# Altium schematic sheet DTX1-1740P.SchDoc
size A4
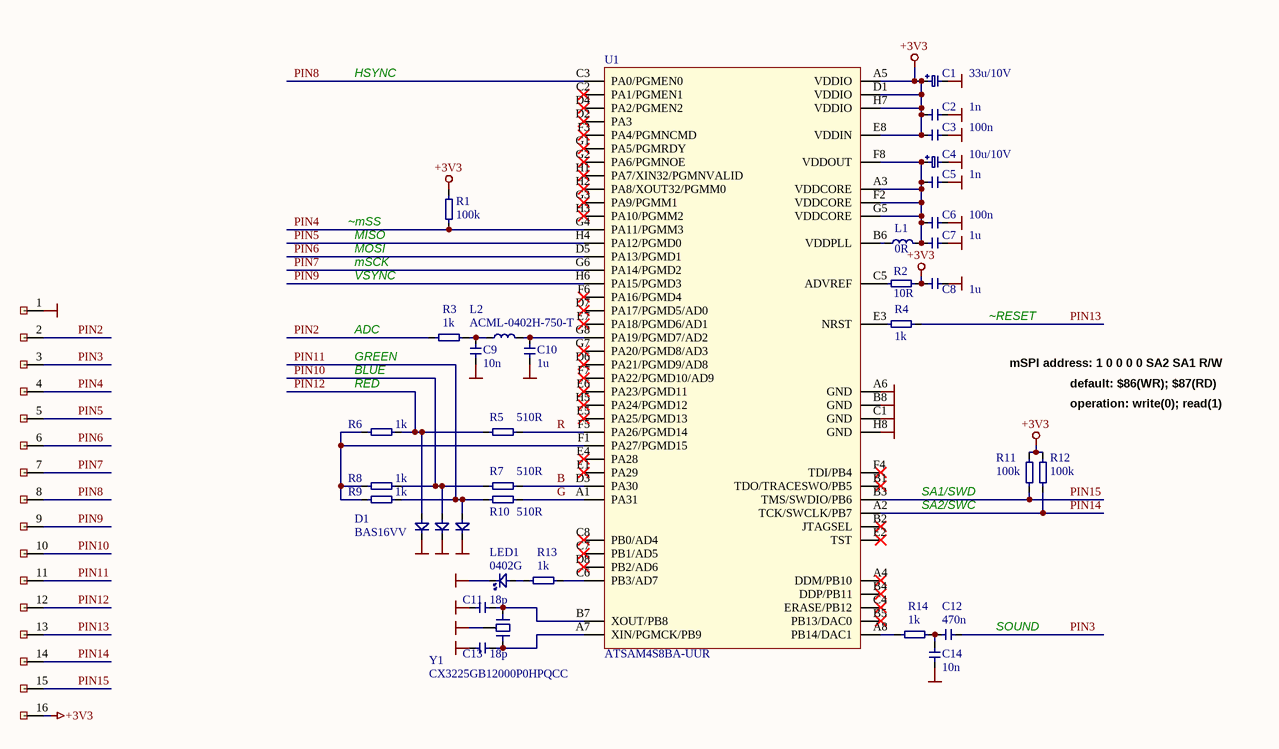
[diagram p0: DTX1-1740P.SchDoc]

## Parts
C1  33u/10V  [Case A (3216)]
C2  1n  [_0201]
C3  100n  [_0201]
C4  10u/10V  [_0805+]
C5  1n  [_0201]
C6  100n  [_0201]
C7  1u  [_0201]
C8  1u  [_0201]
C9  10n  [_0201]
C10  1u  [_0201]
C11  18p  [_0201]
C12  470n  [_0201]
C13  18p  [_0201]
C14  10n  [_0201]
D1  BAS16VV  [SOT666-6]
L1  0R  [_0402]
L2  ACML-0402H-750-T  [_0402]
LED1  0402G  [_0402+]
PIN1  Pin/Pad  [Pad T/H 45/90]  (value not drawn)
PIN2  Pin/Pad  [Pad T/H 45/90]  (value not drawn)
PIN3  Pin/Pad  [Pad T/H 45/90]  (value not drawn)
PIN4  Pin/Pad  [Pad T/H 45/90]  (value not drawn)
PIN5  Pin/Pad  [Pad T/H 45/90]  (value not drawn)
PIN6  Pin/Pad  [Pad T/H 45/90]  (value not drawn)
PIN7  Pin/Pad  [Pad T/H 45/90]  (value not drawn)
PIN8  Pin/Pad  [Pad T/H 45/90]  (value not drawn)
PIN9  Pin/Pad  [Pad T/H 45/90]  (value not drawn)
PIN10  Pin/Pad  [Pad T/H 45/90]  (value not drawn)
PIN11  Pin/Pad  [Pad T/H 45/90]  (value not drawn)
PIN12  Pin/Pad  [Pad T/H 45/90]  (value not drawn)
PIN13  Pin/Pad  [Pad T/H 45/90]  (value not drawn)
PIN14  Pin/Pad  [Pad T/H 45/90]  (value not drawn)
PIN15  Pin/Pad  [Pad T/H 45/90]  (value not drawn)
PIN16  Pin/Pad  [Pad T/H 45/90]  (value not drawn)
R1  100k  [_0201]
R2  10R  [_0201]
R3  1k  [_0201]
R4  1k  [_0201]
R5  510R  [_0201]
R6  1k  [_0201]
R7  510R  [_0201]
R8  1k  [_0201]
R9  1k  [_0201]
R10  510R  [_0201]
R11  100k  [_0201]
R12  100k  [_0201]
R13  1k  [_0201]
R14  1k  [_0201]
U1  ATSAM4S8BA-UUR  [WLCSP64]
Y1  CX3225GB12000P0HPQCC  [Crystal 32x25 (4)]

## Nets
+3V3: C1.1 C2.1 C3.1 C8.1 PIN16.16 R1.2 R2.2 R11.2 R12.2 U1.A5(VDDIO) U1.D1(VDDIO) U1.E8(VDDIN) U1.H7(VDDIO)
GND: C1.2 C2.2 C3.2 C4.2 C5.2 C6.2 C7.2 C8.2 C9.1 C10.1 C11.1 C13.1 C14.1 D1.4 D1.5 D1.6 LED1.1 PIN1.1 U1.A6(GND) U1.B8(GND) U1.C1(GND) U1.H8(GND) Y1.3(GND)
B: R7.2 U1.D3(PA30)
G: R10.2 U1.A1(PA31)
PIN2: PIN2.2 R3.1
PIN3: C12.2 PIN3.3
PIN4: PIN4.4 R1.1 U1.G4(PA11/PGMM3)
PIN5: PIN5.5 U1.H4(PA12/PGMD0)
PIN6: PIN6.6 U1.D5(PA13/PGMD1)
PIN7: PIN7.7 U1.G6(PA14/PGMD2)
PIN8: PIN8.8 U1.C3(PA0/PGMEN0)
PIN9: PIN9.9 U1.H6(PA15/PGMD3)
PIN10: D1.2 PIN10.10 R7.1 R8.2
PIN11: D1.3 PIN11.11 R9.2 R10.1
PIN12: D1.1 PIN12.12 R5.1 R6.2
PIN13: PIN13.13 R4.2
PIN14: PIN14.14 R12.1 U1.A2(TCK/SWCLK/PB7)
PIN15: PIN15.15 R11.1 U1.B3(TMS/SWDIO/PB6)
R: R5.2 U1.F5(PA26/PGMD14)
NetC4_1: C4.1 C5.1 C6.1 C7.1 L1.2 U1.A3(VDDCORE) U1.F2(VDDCORE) U1.F8(VDDOUT) U1.G5(VDDCORE)
NetC9_2: C9.2 L2.1 R3.2
NetC10_2: C10.2 L2.2 U1.G8(PA19/PGMD7/AD2)
NetC11_2: C11.2 U1.B7(XOUT/PB8) Y1.2
NetC12_1: C12.1 C14.2 R14.1
NetC13_2: C13.2 U1.A7(XIN/PGMCK/PB9) Y1.1
NetL1_1: L1.1 U1.B6(VDDPLL)
NetLED1_2: LED1.2 R13.1
NetR2_1: R2.1 U1.C5(ADVREF)
NetR4_1: R4.1 U1.E3(NRST)
NetR6_1: R6.1 R8.1 R9.1 U1.F1(PA27/PGMD15)
NetR13_2: R13.2 U1.C6(PB3/AD7)
NetR14_2: R14.2 U1.A8(PB14/DAC1)

Not connected (* = marked no-connect by the designer): U1 A4(DDM/PB10)* B1(TDO/TRACESWO/PB5)* B2(JTAGSEL)* B4(DDP/PB11)* B5(PB13/DAC0)* C2(PA1/PGMEN1)* C4(ERASE/PB12)* C7(PB1/AD5)* C8(PB0/AD4)* D2(PA3)* D4(PA2/PGMEN2)* D6(PA21/PGMD9/AD8)* D7(PA17/PGMD5/AD0)* D8(PB2/AD6)* E1(PA29)* E2(TST)* E4(PA28)* E5(PA25/PGMD13)* E6(PA23/PGMD11)* E7(PA18/PGMD6/AD1)* F3(PA4/PGMNCMD)* F4(TDI/PB4)* F6(PA16/PGMD4)* F7(PA22/PGMD10/AD9)* G1(PA5/PGMRDY)* G2(PA6/PGMNOE)* G3(PA9/PGMM1)* G7(PA20/PGMD8/AD3)* H1(PA7/XIN32/PGMNVALID)* H2(PA8/XOUT32/PGMM0)* H3(PA10/PGMM2)* H5(PA24/PGMD12)*

## Notes on the sheet
- HSYNC
- ~mSS
- MOSI
- MISO
- mSCK
- VSYNC
- (near R6) RED
- GREEN
- BLUE
- ADC
- ~RESET
- mSPI address: 1 0 0 0 0 SA2 SA1 R/W
- default: $86(WR); $87(RD)
- operation: write(0); read(1)
- SA1/SWD
- SA2/SWC
- SOUND

## Library data of the parts
C1 C4 = Capacitor+: Polar capacitor
C2 C3 C5-C14 = Capacitor
D1 = Diode Triple: Diode (triple)
L1 L2 = Inductor
LED1 = LED: Light Emitting Diode
PIN1-PIN16 = Pin/Pad: Single pin/pad
R1-R14 = Resistor
U1 = AT91SAM4S16Bx WLCSP64: ARM Cortex M4-based Flash MCU; Manufacturer: Atmel
Y1 = Crystal (ground): Crystal Resonator